# EAGLE schematic Pi-puck Expansion (EAGLE 9.5.2)
CNAME: YRL Pi-puck Expansion Board; CREVISION: v1.0; DESIGNER: Russell Joyce
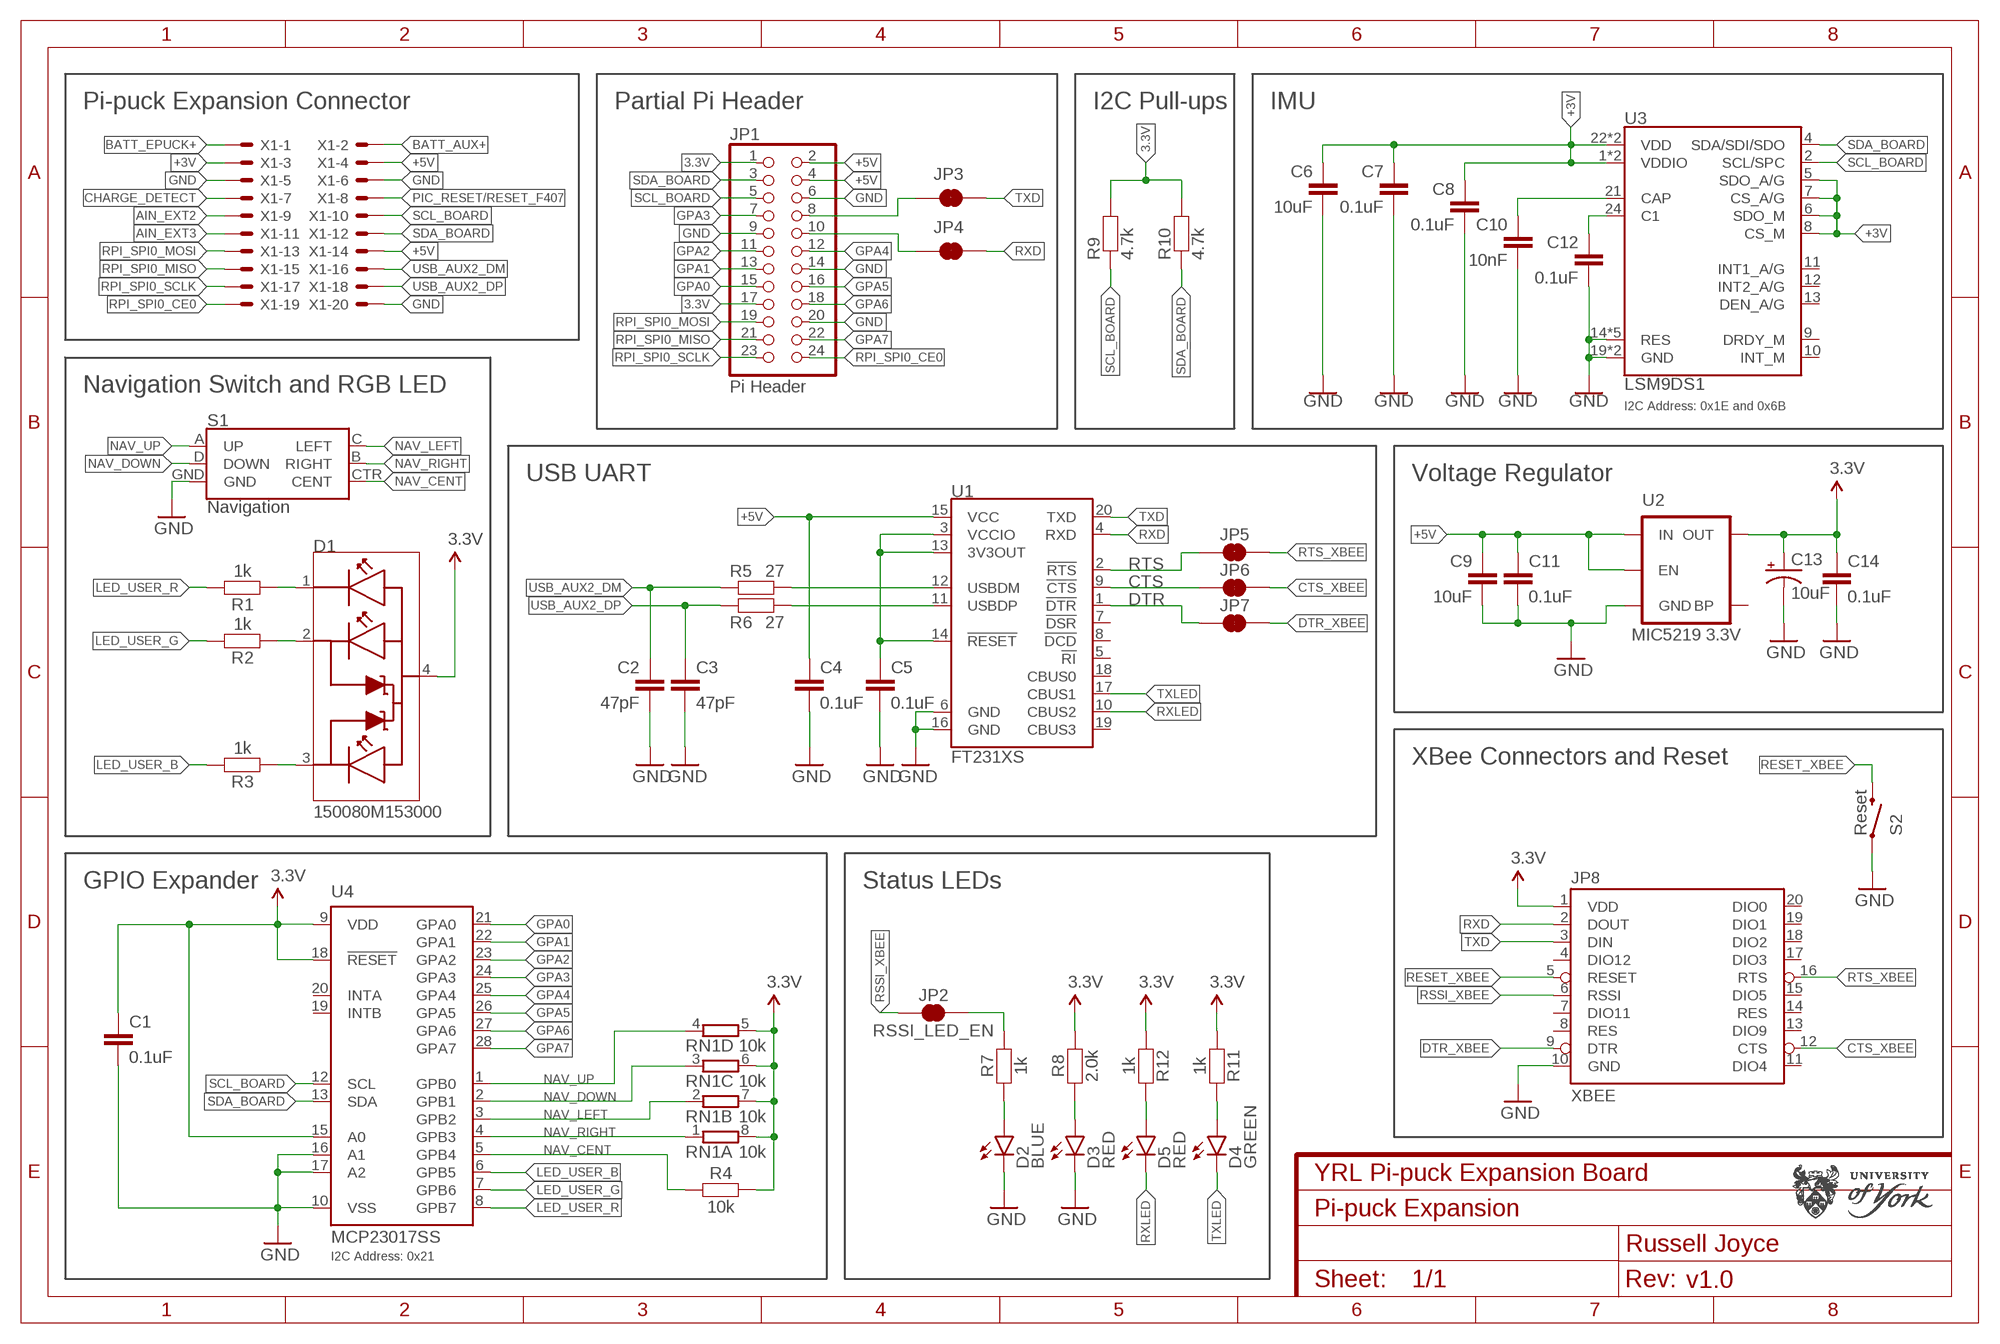
[diagram p0: schematic, sheet 1]

## Parts
C1  0.1uF  0.1UF-0603-25V-(+80/-20%)  [0603]
C2  47pF  47PF-0603-50V-5%  [0603]
C3  47pF  47PF-0603-50V-5%  [0603]
C4  0.1uF  0.1UF-0603-25V-(+80/-20%)  [0603]
C5  0.1uF  0.1UF-0603-25V-(+80/-20%)  [0603]
C6  10uF  10UF-0805-10V-10%  [0805]
C7  0.1uF  0.1UF-0603-25V-(+80/-20%)  [0603]
C8  0.1uF  0.1UF-0603-25V-(+80/-20%)  [0603]
C9  10uF  10UF-0805-10V-10%  [0805]
C10  10nF  10NF-0603-50V-10%  [0603]
C11  0.1uF  0.1UF-0603-25V-(+80/-20%)  [0603]
C12  0.1uF  0.1UF-0603-25V-(+80/-20%)  [0603]
C13  10uF  10UF-POLAR-EIA3216-16V-10%(TANT)  [EIA3216]
C14  0.1uF  0.1UF-0603-25V-(+80/-20%)  [0603]
D1  150080M153000  [LED_150080M153000]
D2  BLUE  LED-BLUE0603  [LED-0603]
D3  RED  LED-RED0603  [LED-0603]
D4  GREEN  LED-GREEN0603  [LED-0603]
D5  RED  LED-RED0603  [LED-0603]
JP1  Pi Header  PINHD-2X12  [2X12]
JP2  RSSI_LED_EN  JUMPER-SMT_2_NC_TRACE_SILK  [SMT-JUMPER_2_NC_TRACE_SILK]
JP3  TXD  JUMPER-SMT_2_NC_TRACE_SILK  [SMT-JUMPER_2_NC_TRACE_SILK]
JP4  RXD  JUMPER-SMT_2_NC_TRACE_SILK  [SMT-JUMPER_2_NC_TRACE_SILK]
JP5  CTS_EN  JUMPER-SMT_2_NC_TRACE_SILK  [SMT-JUMPER_2_NC_TRACE_SILK]
JP6  RTS_EN  JUMPER-SMT_2_NC_TRACE_SILK  [SMT-JUMPER_2_NC_TRACE_SILK]
JP7  DTR  JUMPER-SMT_2_NC_TRACE_SILK  [SMT-JUMPER_2_NC_TRACE_SILK]
JP8  XBEE  XBEESILK  [XBEE-SILK]
LOGO1  UOY-LOGO-30MM  [UOY-LOGO-30MM-WIDE]
LOGO2  UOY-LOGO-10MM  [UOY-LOGO-10MM-WIDE]
R1  1k  1KOHM-0603-1/10W-1%  [0603]
R2  1k  1KOHM-0603-1/10W-1%  [0603]
R3  1k  1KOHM-0603-1/10W-1%  [0603]
R4  10k  10KOHM-0603-1/10W-1%  [0603]
R5  27  27OHM-0603-1/10W-1%  [0603]
R6  27  27OHM-0603-1/10W-1%  [0603]
R7  1k  1KOHM-0603-1/10W-1%  [0603]
R8  2.0k  2.0KOHM-0603-1/10W-5%  [0603]
R9  4.7k  4.7KOHM-0603-1/10W-1%  [0603]
R10  4.7k  4.7KOHM-0603-1/10W-1%  [0603]
R11  1k  1KOHM-0603-1/10W-1%  [0603]
R12  1k  1KOHM-0603-1/10W-1%  [0603]
RN1  10k  4R-NEXBV8V  [EXBV8V]
S1  Navigation  JOYSTICK_MINI  [JOYSTICK_MINI]
S2  Reset  MOMENTARY-SWITCH-SPST-SMD-4.6X2.8MM  [TACTILE_SWITCH_SMD_4.6X2.8MM]
U1  FT231XS  [SSOP20_L]
U2  MIC5219 3.3V  V_REG_MIC52193.3V  [SOT23-5]
U3  LSM9DS1  [LGA24-8X4]
U4  MCP23017SS  [SSOP28]
X1  87758-2016  [87758-2016]

## Nets
3.3V: C1.1 C13.+ C14.1 D1.4(A) JP1.1 JP1.17 JP8.1(VDD) R4.2 R8.2 R9.2 R10.2 R11.1 R12.1 RN1.5 RN1.6 RN1.7 RN1.8 U2.5(OUT) U4.9(VDD) U4.15(A0) U4.18(!RESET)
3V-INT: C5.1 U1.3(VCCIO) U1.13(3V3OUT) U1.14(!RESET)
+3V: C6.1 C7.1 C8.1 U3.1(VDDIO) U3.3(VDDIO) U3.5(SDO_A/G) U3.6(SDO_M) U3.7(CS_A/G) U3.8(CS_M) U3.22(VDD) U3.23(VDD) X1.3
+5V: C4.1 C9.1 C11.1 JP1.2 JP1.4 U1.15(VCC) U2.1(IN) U2.3(EN) X1.4 X1.14
AIN_EXT2: X1.9
AIN_EXT3: X1.11
BATT_AUX+: X1.2
BATT_EPUCK+: X1.1
C1: C12.1 U3.24(C1)
CAP: C10.1 U3.21(CAP)
CHARGE_DETECT: X1.7
CTS: JP6.1 U1.9(!CTS)
CTS_XBEE: JP6.2 JP8.12(CTS)
DTR: JP7.1 U1.1(!DTR)
DTR_XBEE: JP7.2 JP8.9(DTR)
GND: C1.2 C2.2 C3.2 C4.2 C5.2 C6.2 C7.2 C8.2 C9.2 C10.2 C11.2 C12.2 C13.- C14.2 D2.C D3.C JP1.6 JP1.9 JP1.14 JP1.20 JP8.10(GND) S1.GND S2.1 S2.2 U1.6(GND) U1.16(GND) U2.2(GND) U3.14(RES) U3.15(RES) U3.16(RES) U3.17(RES) U3.18(RES) U3.19(GND) U3.20(GND) U4.10(VSS) U4.16(A1) U4.17(A2) X1.5 X1.6 X1.20
GPA0: JP1.15 U4.21(GPA0)
GPA1: JP1.13 U4.22(GPA1)
GPA2: JP1.11 U4.23(GPA2)
GPA3: JP1.7 U4.24(GPA3)
GPA4: JP1.12 U4.25(GPA4)
GPA5: JP1.16 U4.26(GPA5)
GPA6: JP1.18 U4.27(GPA6)
GPA7: JP1.22 U4.28(GPA7)
LED_USER_B: R3.2 U4.6(GPB5)
LED_USER_G: R2.2 U4.7(GPB6)
LED_USER_R: R1.2 U4.8(GPB7)
N$1: D5.A R12.2
N$2: JP1.8 JP3.1
N$3: JP1.10 JP4.1
N$4: D4.A R11.2
N$6: D1.1(R) R1.1
N$7: R6.2 U1.11(USBDP)
N$8: R5.2 U1.12(USBDM)
N$9: JP2.2 R7.2
N$10: D1.2(G) R2.1
N$11: D1.3(B) R3.1
N$38: D3.A R8.1
NAV_CENT: R4.1 S1.CTR(CENT) U4.5(GPB4)
NAV_DOWN: RN1.3 S1.D(DOWN) U4.2(GPB1)
NAV_LEFT: RN1.2 S1.C(LEFT) U4.3(GPB2)
NAV_RIGHT: RN1.1 S1.B(RIGHT) U4.4(GPB3)
NAV_UP: RN1.4 S1.A(UP) U4.1(GPB0)
PIC_RESET/RESET_F407: X1.8
RESET_XBEE: JP8.5(RESET) S2.3 S2.4
RPI_SPI0_CE0: JP1.24 X1.19
RPI_SPI0_MISO: JP1.21 X1.15
RPI_SPI0_MOSI: JP1.19 X1.13
RPI_SPI0_SCLK: JP1.23 X1.17
RSSI_XBEE: JP2.1 JP8.6(RSSI)
RSSILED: D2.A R7.1
RTS: JP5.1 U1.2(!RTS)
RTS_XBEE: JP5.2 JP8.16(RTS)
RXD: JP4.2 JP8.2(DOUT) U1.4(RXD)
RXLED: D5.C U1.10(CBUS2)
SCL_BOARD: JP1.5 R9.1 U3.2(SCL/SPC) U4.12(SCL) X1.10
SDA_BOARD: JP1.3 R10.1 U3.4(SDA/SDI/SDO) U4.13(SDA) X1.12
TXD: JP3.2 JP8.3(DIN) U1.20(TXD)
TXLED: D4.C U1.17(CBUS1)
USB_AUX2_DM: C2.1 R5.1 X1.16
USB_AUX2_DP: C3.1 R6.1 X1.18
Unconnected: JP8.4(DIO12) JP8.7(DIO11) JP8.8(RES) JP8.11(DIO4) JP8.13(DIO9) JP8.14(RES) JP8.15(DIO5) JP8.17(DIO3) JP8.18(DIO2) JP8.19(DIO1) JP8.20(DIO0) U1.5(!RI) U1.7(!DSR) U1.8(!DCD) U1.18(CBUS0) U1.19(CBUS3) U2.4(BP) U3.9(DRDY_M) U3.10(INT_M) U3.11(INT1_A/G) U3.12(INT2_A/G) U3.13(DEN_A/G) U4.19(INTB) U4.20(INTA)

## Notes on the sheet
- Pi-puck Expansion Connector | Partial Pi Header | I2C Pull-ups | IMU
- Navigation Switch and RGB LED
- I2C Address: 0x1E and 0x6B
- USB UART | Voltage Regulator
- XBee Connectors and Reset
- GPIO Expander | Status LEDs
- I2C Address: 0x21

## Library data of the parts
C1 C4 C5 C7 C8 C11 C12 C14 = SparkFun-Capacitors:0.1UF: 0.1µF ceramic capacitors A capacitor is a passive two-terminal electrical component used to store electrical energy temporarily in an electric field.; PROD_ID: CAP-00810
C2 C3 = SparkFun-Capacitors:47PF: 47pF ceramic capacitors A capacitor is a passive two-terminal electrical component used to store electrical energy temporarily in an electric field.; PROD_ID: CAP-08913
C6 C9 = SparkFun-Capacitors:10UF: 10.0µF ceramic capacitors A capacitor is a passive two-terminal electrical component used to store electrical energy temporarily in an electric field.; PROD_ID: CAP-11330
C10 = SparkFun-Capacitors:10NF: 0.01uF/10nF/10,000pF ceramic capacitors A capacitor is a passive two-terminal electrical component used to store electrical energy temporarily in an electric field. CAP-09321; PROD_ID: CAP-00867
C13 = SparkFun-Capacitors:10UF-POLAR: 10.0µF polarized capacitors A capacitor is a passive two-terminal electrical component used to store electrical energy temporarily in an electric field.; PROD_ID: CAP-00811
D1 = 150080M153000:150080M153000: SMD Full Color LED Chip RGB 3.9 V 0805 | Würth Elektronik 150080M153000 @ LED, SMD (SMD Full Color LED Chip RGB 3.9 V...; AVAILABILITY: Unavailable; DESCRIPTION: SMD Full Color LED Chip RGB 3.9 V 0805 | Würth Elektronik 150080M153000 @ LED, SMD _SMD Full Color LED Chip RGB 3.9 V...; MF: Wurth Electronics; MP: 150080M153000; PACKAGE: SMD-4 Würth Elektronik; PRICE: None
D2 = SparkFun-LED:LED-BLUE: Blue SMD LED Used in manufacturing of various products at SparkFun Packages: 0603 - SMD 0603 package [Product Link] <http://www.digikey.com/product-detail/en/SMLE12BC7TT86/511-1589-2-ND/1641808> 1206 - SMD1206 package [Product Link] <http://www.digikey.com/product-detail/en/lite-on-inc/LTST-C150TBKT/160-1643-1-ND/573584> SparkFun Products: ESP8266 Thing-Dev Board <https://www.sparkfun.com/products/13711> RedBoard <https://www.sparkfun.com/products/12757>; PROD_ID: DIO-08575
D3 D5 = SparkFun-LED:LED-RED: Red SMD LED Used in manufacturing of most products at SparkFun Packages: 0603 - SMD 0603 package [Product Link] <http://docs.avagotech.com/docs/AV02-0551EN> 0603 SMART - SMD 0603 SMART package ( more efficient and expensive)[Product Link] <http://www.osram-os.com/Graphics/XPic2/00077099_0.pdf> 1206 - SMD1206 package [Product Link] <https://www.sparkfun.com/datasheets/DevTools/LilyPad/Q150OVS4.pdff> SparkFun Products: Pro Mini 328 -5V <https://www.sparkfun.com/products/821> RedBoard <https://www.sparkfun.com/products/12757> IOIO-OTG <https://www.sparkfun.com/products/13613>; PROD_ID: DIO-00819
D4 = SparkFun-LED:LED-GREEN: Green SMD LED Used in manufacturing of various products at SparkFun Packages: 0603 - SMD 0603 package [Product Link] <http://www.futureelectronics.com/en/technologies/semiconductors/optoelectronics/leds/Pages/9894312-LTST-C190GKT.aspx?CrossPart=HSMG-C190&IM=0> LilyPad 1206 - SMD1206 LilyPad package [Product Link] <http://www.futureelectronics.com/en/Technologies/Product.aspx?ProductID=IN150NGHARVATEKCORPORATION2049943&IM=0> 1206 - SMD1206 package [Product Link] <http://www.futureelectronics.com/en/technologies/semiconductors/optoelectronics/leds/Pages/8315665-LTST-C150KGKT.aspx?IM=0> 1206 Bottom Mount -SMD 1206 Bottom Mount [Product Link] <http://www.digikey.com/product-detail/en/lite-on-inc/LTST-C230KGKT/160-1456-1-ND/386854> SparkFun Products: Pro Mini 328 -5V <https://www.sparkfun.com/products/821> RedBoard <https://www.sparkfun.com/products/12757> MP3 Trigger <https://www.sparkfun.com/products/13720> Makey Makey <https://www.sparkfun.com/products/11076>; PROD_ID: DIO-00821
JP1 = pinhead:PINHD-2X12: PIN HEADER
JP2-JP7 = SparkFun-Jumpers:JUMPER-SMT_2_NC_TRACE: Normally closed trace jumper This jumper has a trace between two pads so it's normally closed (NC). Use a razor knife to open the connection. For best results follow the IPC guidelines for cutting traces: Cutout at least 0.063 mm (0.005 in). Remove all loose material to clean up the cut area. Seal the cut with an approved epoxy. Reapply solder to reclose the connection.
JP8 = SparkFun-RF:XBEE: Digi XBee and XBee Pro XBees are tiny blue chips that can communicate wirelessly with each other. They can do simple things, like replacing a couple of wires in serial communication, which is nice when you want to make a remote for your paintball vehicle. SparkFun Products SparkFun XBee Buying Guide <https://www.sparkfun.com/pages/xbee_guide> SparkFun XBee Explorer USB <https://www.sparkfun.com/products/11812> (WRL-11812) Breakout Board for XBee Module <https://www.sparkfun.com/products/8276> (WRL-8276) SparkFun XBee Explorer Regulated <https://www.sparkfun.com/products/11373> (WRL-11373) SparkFun XBee Explorer Dongle <https://www.sparkfun.com/products/11697> (WRL-11697) SparkFun XBee Shield <https://www.sparkfun.com/products/12847> (WRL-12847) SparkFun XBee Explorer Serial <https://www.sparkfun.com/products/13225> (WRL-13225)
LOGO1 = yrl-logos:UOY-LOGO-30MM
LOGO2 = yrl-logos:UOY-LOGO-10MM
R1-R3 R7 R11 R12 = SparkFun-Resistors:1KOHM: 1kΩ resistor A resistor is a passive two-terminal electrical component that implements electrical resistance as a circuit element. Resistors act to reduce current flow, and, at the same time, act to lower voltage levels within circuits. - Wikipedia; PROD_ID: RES-07856
R4 = SparkFun-Resistors:10KOHM: 10kΩ resistor A resistor is a passive two-terminal electrical component that implements electrical resistance as a circuit element. Resistors act to reduce current flow, and, at the same time, act to lower voltage levels within circuits. - Wikipedia; PROD_ID: RES-00824
R5 R6 = SparkFun-Resistors:27OHM: 27Ω resistor A resistor is a passive two-terminal electrical component that implements electrical resistance as a circuit element. Resistors act to reduce current flow, and, at the same time, act to lower voltage levels within circuits. - Wikipedia; PROD_ID: RES-09334
R8 = SparkFun-Resistors:2.0KOHM: 2kΩ resistor A resistor is a passive two-terminal electrical component that implements electrical resistance as a circuit element. Resistors act to reduce current flow, and, at the same time, act to lower voltage levels within circuits. - Wikipedia; PROD_ID: RES-08296
R9 R10 = SparkFun-Resistors:4.7KOHM: 4.7kΩ resistor A resistor is a passive two-terminal electrical component that implements electrical resistance as a circuit element. Resistors act to reduce current flow, and, at the same time, act to lower voltage levels within circuits. - Wikipedia; PROD_ID: RES-07857
RN1 = resistor-dil:4R-N: Array Chip Resistor Source: RS Component / Phycomp; OC_FARNELL: unknown; OC_NEWARK: unknown
S1 = SparkFun-Switches:JOYSTICK_MINI: Small Tactile Joystick w/ Select Switch A 5-way tactile switch allows for a joystick-like interface in a very small package. Part #: 4UCON SF303GJ26 SparkFun Products 5-way Tactile Switch <https://www.sparkfun.com/products/10063> (COM-10063) Used on SparkFun Block for Intel® Edison - OLED <https://www.sparkfun.com/products/13035> (DEV-13035) Used on CAN-BUS Shield <https://www.sparkfun.com/products/13262> (DEV-13262); PROD_ID: SWCH-09905; SF_SKU: COM-10063
S2 = SparkFun-Switches:MOMENTARY-SWITCH-SPST: Momentary Switch (Pushbutton) - SPST Normally-open (NO) SPST momentary switches (buttons, pushbuttons). Variants PTH-12MM - 12mm square, through-hole Momentary Pushbutton Switch - 12mm Square <https://www.sparkfun.com/products/9190> (COM-09190) PTH-6.0MM, PTH-6.0MM-KIT - 6.0mm square, through-hole Mini Pushbutton Switch <https://www.sparkfun.com/products/97> (COM-00097) KIT package intended for soldering kit's - only one side of pads' copper is exposed. PTH-RIGHT-ANGLE-KIT - Right-angle, through-hole Right Angle Tactile Button <https://www.sparkfun.com/products/10791> - Used on SparkFun BigTime Watch Kit <https://www.sparkfun.com/products/11734> SMD-12MM - 12mm square, surface-mount Tactile Button - SMD (12mm) <https://www.sparkfun.com/products/12993> (COM-12993) Used on SparkFun PicoBoard <https://www.sparkfun.com/products/11888> SMD-4.5MM - 4.5mm Square Trackball Switch Used on SparkFun Blackberry Trackballer Breakout <https://www.sparkfun.com/products/13169> SMD-4.6MMX2.8MM - 4.60mm x 2.80mm, surface mount Used on SparkFun SAMD21 Mini Breakout <https://www.sparkfun.com/products/13664> SMD-5.2MM, SMD-5.2-REDUNDANT - 5.2mm square, surface-mount Mini Pushbutton Switch - SMD <https://www.sparkfun.com/products/8720> (COM-08720) Used on Arduino Pro Mini <https://www.sparkfun.com/products/11114> REDUNDANT package connects both switch circuits together SMD-6.0X3.5MM - 6.0 x 3.5mm, surface mount Momentary Reset Switch SMD <https://www.sparkfun.com/products/8229> (COM-08229) SMD-6.2MM-TALL - 6.2mm square, surface mount Tactile Button - SMD (6mm) <https://www.sparkfun.com/products/12992> Used on SparkFun Digital Sandbox <https://www.sparkfun.com/products/12651> SMD-RIGHT-ANGLE - Right-angle, surface mount Used on SparkFun Block for Intel® Edison - Arduino <https://www.sparkfun.com/products/13036>; PROD_ID: SWCH-13065
U1 = SparkFun-IC-Comms:FT231X: FTDI FT231X Full Speed USB to Full-handshake UART This USB2.0 Full Speed IC offers a compact bridge to full handshake UART interfaces. The device is a UART, capable of operating up to 3MBaud, with low power consumption (8mA). The FT231X includes the complete FT-X series feature set and enables USB to be added into a system design quickly and easily over a UART interface. Datasheet <http://cdn.sparkfun.com/datasheets/Components/General%20IC/DS_FT231X.pdf> SparkFun Products SparkFun RedBoard - Programmed with Arduino <https://www.sparkfun.com/products/12757> (DEV-12757) SparkFun XBee Explorer USB <https://www.sparkfun.com/products/11812> (WRL-11812) SparkFun XBee Explorer Dongle <https://www.sparkfun.com/products/11697> (WRL-11697) SparkFun Blynk Board - ESP8266 <https://www.sparkfun.com/products/13794> (WRL-13794) SparkFun ESP8266 Thing - Dev Board <https://www.sparkfun.com/products/13711> (WRL-13711) SparkFun Block for Intel® Edison - Base <https://www.sparkfun.com/products/13045> (DEV-13045) SparkFun RedStick <https://www.sparkfun.com/products/13741> (DEV-13741) SparkFun Beefy 3 - FTDI Basic Breakout <https://www.sparkfun.com/products/13746> (DEV-13746) SparkFun FT231X Breakout <https://www.sparkfun.com/products/11736> (BOB-11736); PROD_ID: IC-11524
U2 = SparkFun-IC-Power:V_REG_MIC5219: V_REG MIC5219 Standard 3.3V and 5V 500mA LDO voltage regulator in SOT-23 layout. Micrel part MIC5219. BP (by-pass) pin is used to lower output noise with 470pF cap, may be left open.; PROD_ID: VREG-09872
U3 = LSM9DS1:LSM9DS1: LSM9DS1 3D accelerometer, gyroscope & magnetometer The LSM9DS1 is a system-in-package featuring a 3D digital linear acceleration sensor, a 3D digital angular rate sensor, and a 3D digital magnetic sensor. The LSM9DS1 has a linear acceleration full scale of ±2g/±4g/±8/±16 g, a magnetic field full scale of ±4/±8/±12/±16 gauss and an angular rate of ±245/±500/±2000 dps. The LSM9DS1 includes an I2 C serial bus interface supporting standard and fast mode (100 kHz and 400 kHz) and an SPI serial standard interface. Magnetic, accelerometer and gyroscope sensing can be enabled or set in power-down mode separately for smart power management. The LSM9DS1 is available in a plastic land grid array package (LGA) and it is guaranteed to operate over an extended temperature range from -40 °C to +85 °C.; PROD_ID: IC-12536
U4 = microchip:MCP23017: http://ww1.microchip.com/downloads/en/DeviceDoc/21952a.pdf Source: http://ww1.microchip.com/downloads/en/DeviceDoc/21952a.pdf; MF: MICROCHIP; MPN: MCP23017-E/SS; OC_FARNELL: 1467674; OC_NEWARK: 31K2960
X1 = con-molex:87758-2016: 20 Pin - 2mm Dual Row Single Wafer, Vertical T/H HDR Source: http://www.molex.com/pdm_docs/sd/877580616_sd.pdf; MF: MOLEX; MPN: 87758-2016; OC_FARNELL: 7472374; OC_NEWARK: 25M5677

## Net classes
0 default: width 0.203 mm